# EAGLE design Ad8232_placa_C_malha (EAGLE 9.6.2)
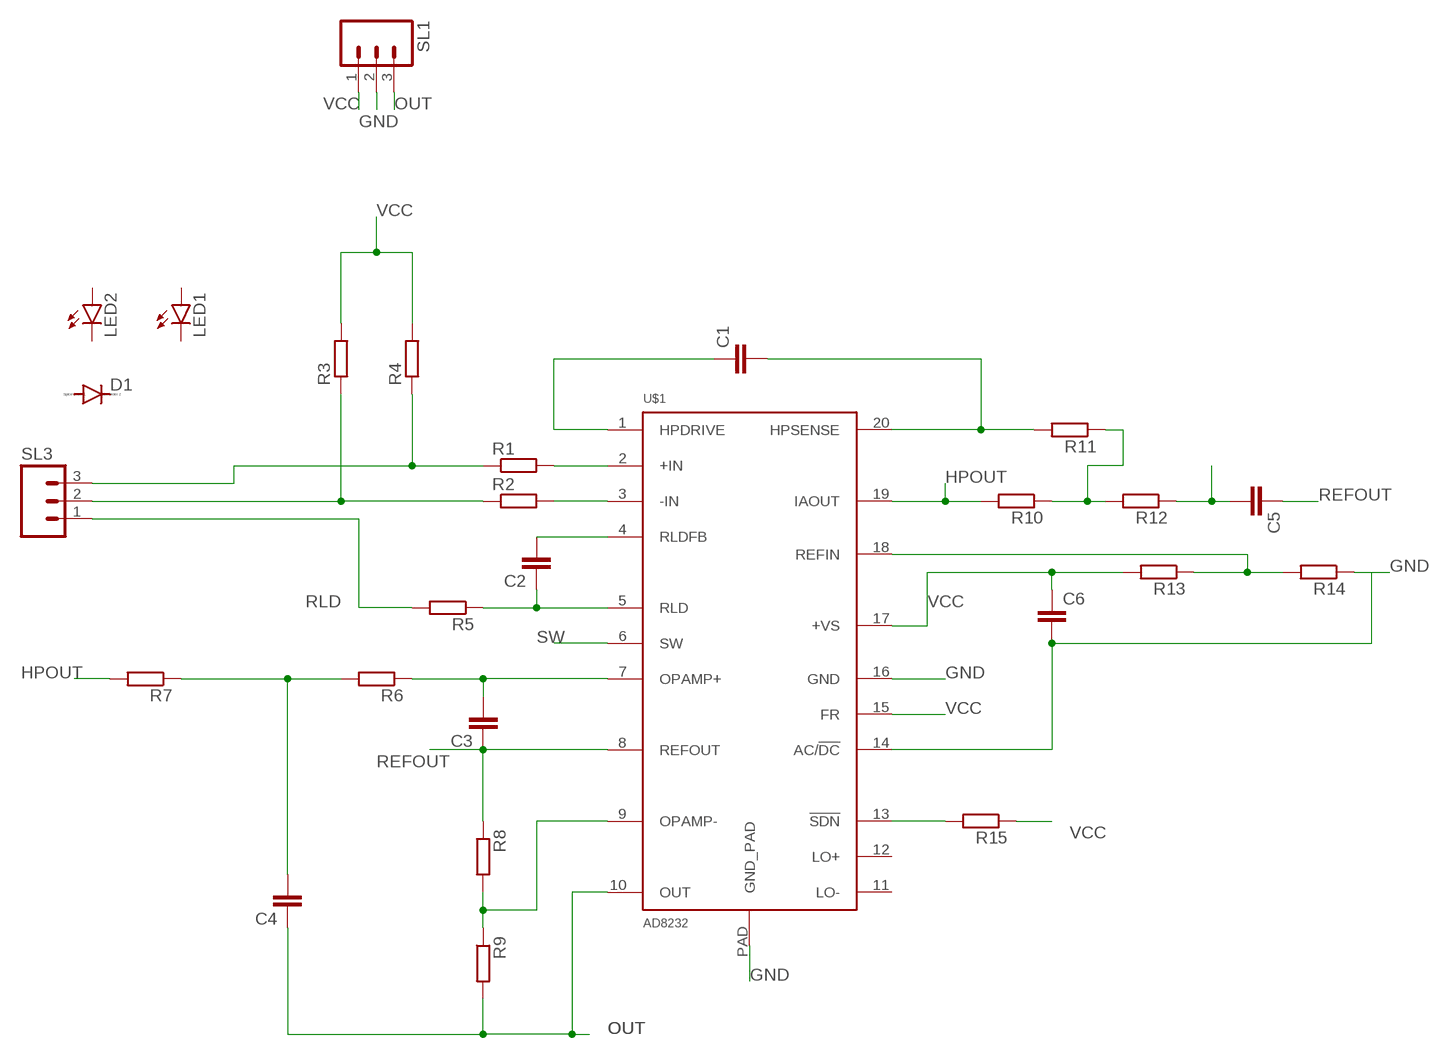
[diagram p0: schematic, sheet 1]

## Parts
C1  C-EUC0805  [C0805]
C2  C-EUC0805  [C0805]
C3  C-EUC0805  [C0805]
C4  C-EUC0805  [C0805]
C5  C-EUC0805  [C0805]
C6  C-EUC0805  [C0805]
D1  DIODE-MINIMELF  [MINIMELF]
LED1  LEDCHIPLED_0603  [CHIPLED_0603]
LED2  LEDCHIPLED_0603  [CHIPLED_0603]
R1  R-EU_R0805  [R0805]
R2  R-EU_R0805  [R0805]
R3  R-EU_R0805  [R0805]
R4  R-EU_R0805  [R0805]
R5  R-EU_R0805  [R0805]
R6  R-EU_R0805  [R0805]
R7  R-EU_R0805  [R0805]
R8  R-EU_R0805  [R0805]
R9  R-EU_R0805  [R0805]
R10  R-EU_R0805  [R0805]
R11  R-EU_R0805  [R0805]
R12  R-EU_R0805  [R0805]
R13  R-EU_R0805  [R0805]
R14  R-EU_R0805  [R0805]
R15  R-EU_R0805  [R0805]
SL1  M03  [03P]
SL3  M03  [03P]
U$1  AD8232  [LFCSP_20]

## Nets
GND: C6.2 R14.1 SL1.2 U$1.14(AC/!DC) U$1.16(GND) U$1.PAD(GND_PAD)
HPOUT: R7.2 R10.2 U$1.19(IAOUT)
N$1: C1.1 U$1.1(HPDRIVE)
N$2: C1.2 R11.2 U$1.20(HPSENSE)
N$3: R1.2 U$1.2(+IN)
N$4: R2.2 U$1.3(-IN)
N$5: R1.1 R4.1 SL3.3
N$6: R2.1 R3.1 SL3.2
N$7: C2.2 U$1.4(RLDFB)
N$8: C2.1 R5.1 U$1.5(RLD)
N$9: C3.2 R6.1 U$1.7(OPAMP+)
N$10: R13.1 R14.2 U$1.18(REFIN)
N$11: R8.2 R9.1 U$1.9(OPAMP-)
N$13: R10.1 R11.1 R12.2
N$14: C4.2 R6.2 R7.1
N$16: R15.2 U$1.13(!SDN)
OUT: C4.1 R9.2 SL1.3 U$1.10(OUT)
REFOUT: C3.1 C5.1 R8.1 U$1.8(REFOUT)
RLD: R5.2 SL3.1
SW: C5.2 R12.1 U$1.6(SW)
VCC: C6.1 R3.2 R4.2 R13.2 R15.1 SL1.1 U$1.15(FR) U$1.17(+VS)
Unconnected: D1.A D1.C LED1.A LED1.C LED2.A LED2.C U$1.11(LO-) U$1.12(LO+)

## Library data of the parts
C1-C6 = rcl:C-EU: CAPACITOR, European symbol
D1 = diode:DIODE-: DIODE
LED1 LED2 = led:LED: LED OSRAM: - CHIPLED LG R971, LG N971, LY N971, LG Q971, LY Q971, LO R971, LY R971 LH N974, LH R974 LS Q976, LO Q976, LY Q976 LO Q996 - Hyper CHIPLED LW Q18S LB Q993, LB Q99A, LB R99A - SideLED LS A670, LO A670, LY A670, LG A670, LP A670 LB A673, LV A673, LT A673, LW A673 LH A674 LY A675 LS A676, LA A676, LO A676, LY A676, LW A676 LS A679, LY A679, LG A679 - Hyper Micro SIDELED® LS Y876, LA Y876, LO Y876, LY Y876 LT Y87S - SmartLED LW L88C, LW L88S LB L89C, LB L89S, LG L890 LS L89K, LO L89K, LY L89K LS L896, LA L896, LO L896, LY L896 - TOPLED LS T670, LO T670, LY T670, LG T670, LP T670 LSG T670, LSP T670, LSY T670, LOP T670, LYG T670 LG T671, LOG T671, LSG T671 LB T673, LV T673, LT T673, LW T673 LH T674 LS T676, LA T676, LO T676, LY T676, LB T676, LH T676, LSB T676, LW T676 LB T67C, LV T67C, LT T67C, LS T67K, LO T67K, LY T67K, LW E67C LS E67B, LA E67B, LO E67B, LY E67B, LB E67C, LV E67C, LT E67C LW T67C LS T679, LY T679, LG T679 LS T770, LO T770, LY T770, LG T770, LP T770 LB T773, LV T773, LT T773, LW T773 LH T774 LS E675, LA E675, LY E675, LS T675 LS T776, LA T776, LO T776, LY T776, LB T776 LHGB T686 LT T68C, LB T68C - Hyper Mini TOPLED® LB M676 - Mini TOPLED Santana® LG M470 LS M47K, LO M47K, LY M47K Source: http://www.osram.convergy.de LUXEON: - LUMILED® LXK2-PW12-R00, LXK2-PW12-S00, LXK2-PW14-U00, LXK2-PW14-V00 LXK2-PM12-R00, LXK2-PM12-S00, LXK2-PM14-U00 LXK2-PE12-Q00, LXK2-PE12-R00, LXK2-PE12-S00, LXK2-PE14-T00, LXK2-PE14-U00 LXK2-PB12-K00, LXK2-PB12-L00, LXK2-PB12-M00, LXK2-PB14-N00, LXK2-PB14-P00, LXK2-PB14-Q00 LXK2-PR12-L00, LXK2-PR12-M00, LXK2-PR14-Q00, LXK2-PR14-R00 LXK2-PD12-Q00, LXK2-PD12-R00, LXK2-PD12-S00 LXK2-PH12-R00, LXK2-PH12-S00 LXK2-PL12-P00, LXK2-PL12-Q00, LXK2-PL12-R00 Source: www.luxeon.com KINGBRIGHT: KA-3528ASYC Source: www.kingbright.com
R1-R15 = rcl:R-EU_: RESISTOR, European symbol
SL1 SL3 = con-amp-quick:M03: AMP QUICK CONNECTOR; OC_FARNELL: unknown; OC_NEWARK: unknown
U$1 = AD8232:AD8232: Check prices <https://pricing.snapeda.com/parts/AD8232/Analog%20Devices/view-part?ref=eda>; AVAILABILITY: Not in stock; DESCRIPTION: AD8232 Sensor Signal Conditioner Interface Evaluation Board; MF: Analog Devices; MP: AD8232; PACKAGE: LFCSP-20 Analog Devices; PRICE: None

## Board
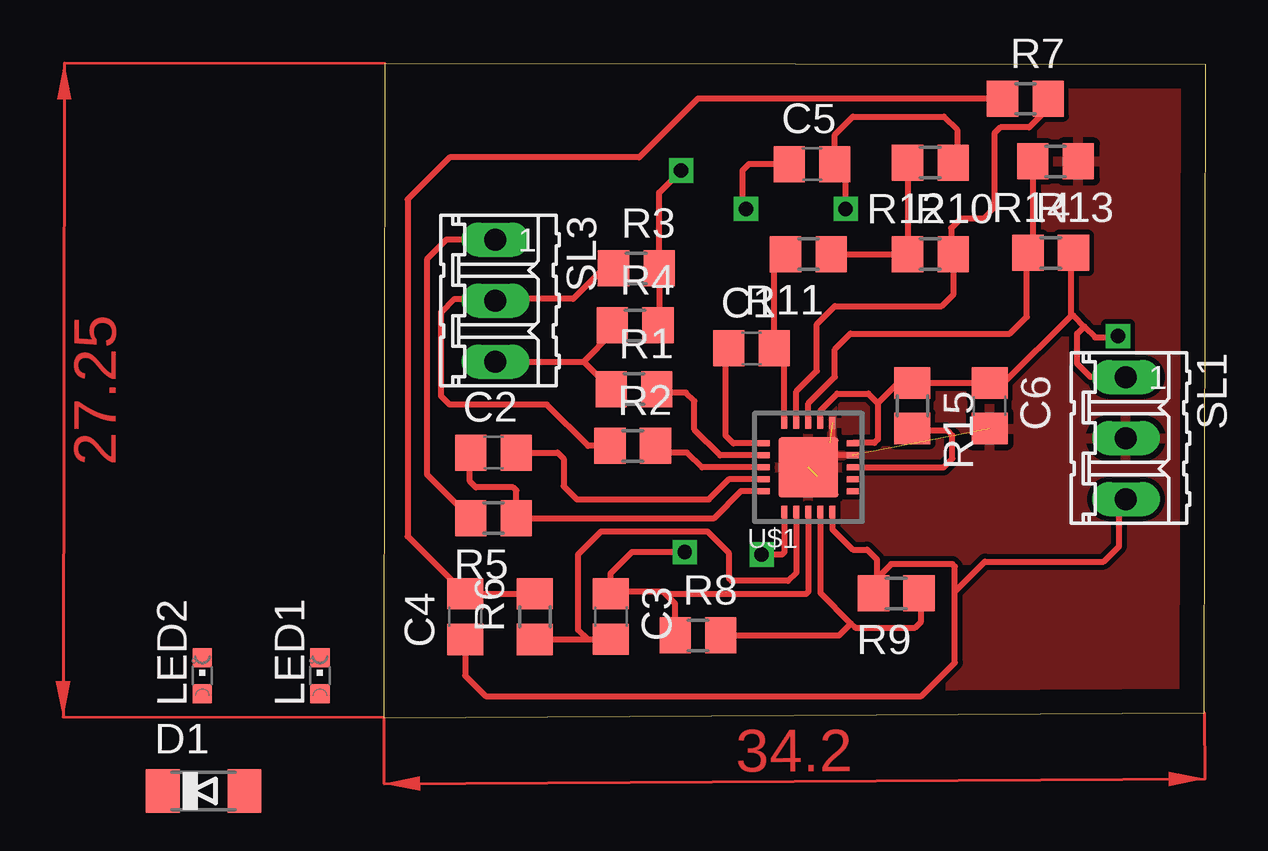
[diagram p1: board, top side]
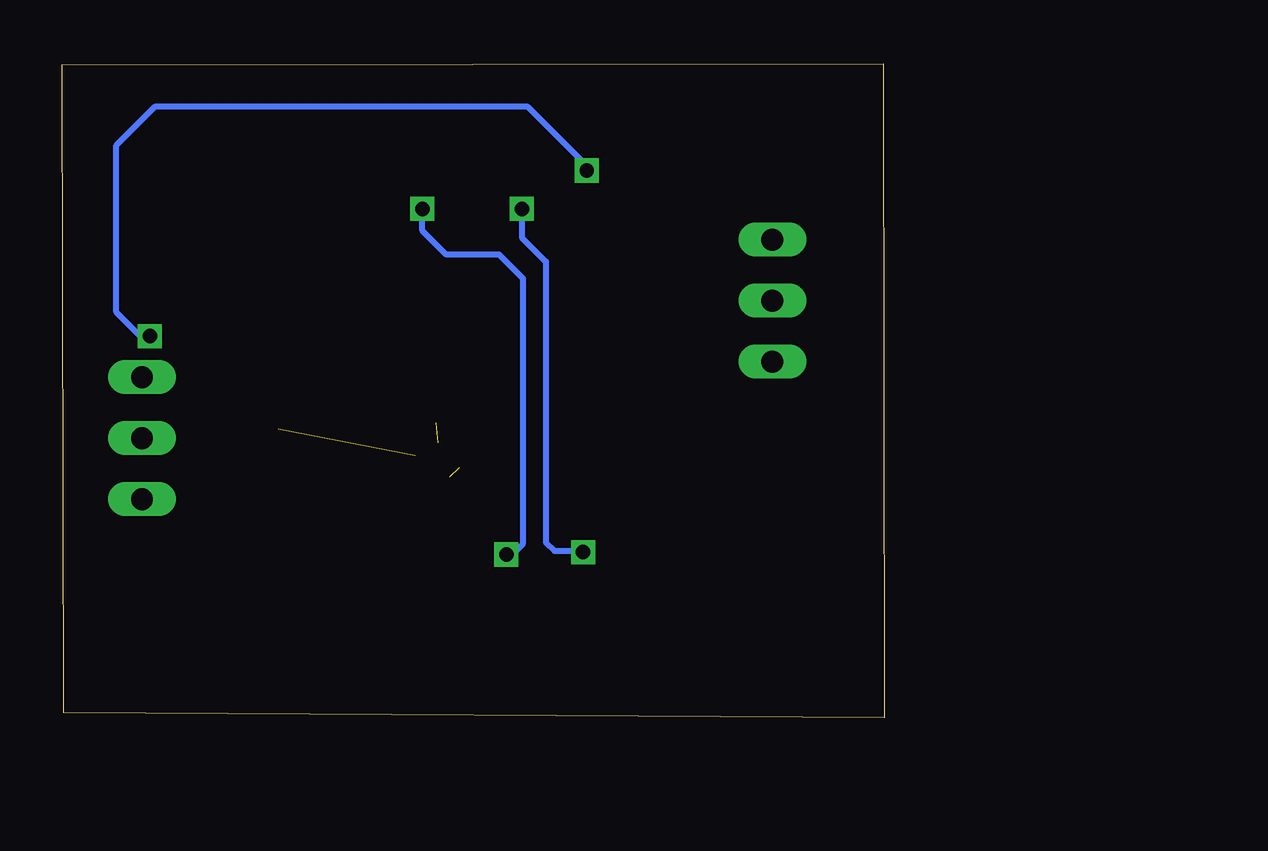
[diagram p2: board, bottom side, seen from below]

Size 34.25 x 27.25 mm. Coordinates in mm from the lower left corner, seen from the top.
Outline: 0,0 34.2,0.2 34.25,27.2 0.05,27.25 0,0
Copper layers (1*16): Top 0.035mm / dielectric 1.5mm / Bottom 0.035mm
Design rules "default": minimum track width 10mil, minimum drill 24mil, track to track 8mil, track to pad 8mil, pad to pad 8mil, via to via 8mil, smd to smd 8mil, copper to edge 40mil, drill to drill 8mil, minimum pad ring 10mil, minimum via ring 8mil, stop-mask expansion 4mil, vias tented up to drill 0mil, thermal gap 10mil

### Footprints (pad centres in the part's own frame; a part is rotated, then mirrored left to right if it is on the bottom)
C0805 = smd 1.3 x 1.5: 1 -0.95,0; 2 0.95,0
MINIMELF = smd 1.4 x 1.8: A 1.7,0; C -1.7,0
CHIPLED_0603 = smd 0.8 x 0.8: A 0,-0.75; C 0,0.75
R0805 = smd 1.3 x 1.5: 1 -0.95,0; 2 0.95,0
03P = drill 0.914 long: 1 -2.54,0; 2 0,0; 3 2.54,0
LFCSP_20 = smd 0.5 x 0.25: 1 -1.85,1; 2 -1.85,0.5; 3 -1.85,0; 4 -1.85,-0.5; 5 -1.85,-1; 11 1.85,-1; 12 1.85,-0.5; 13 1.85,0; 14 1.85,0.5; 15 1.85,1 | smd 0.25 x 0.5: 6 -1,-1.85; 7 -0.5,-1.85; 8 0,-1.85; 9 0.5,-1.85; 10 1,-1.85; 16 1,1.85; 17 0.5,1.85; 18 0,1.85; 19 -0.5,1.85; 20 -1,1.85 | smd 2.5 x 2.5: PAD 0,0

### Placement (x,y rotation side)
C1  15.33,15.39 0 top
C2  4.58,11.05 0 top
C3  9.47,4.22 270 top
C4  3.4,4.21 90 top
C5  17.85,23.07 0 top
C6  25.25,13 270 top
D1  -7.5,-3.05 0 top  (outside the outline)
LED1  -2.65,1.75 0 top
LED2  -7.55,1.75 0 top  (outside the outline)
R1  10.43,13.69 0 top
R2  10.38,11.33 0 top
R3  10.53,18.72 0 top
R4  10.48,16.35 0 top
R5  4.58,8.32 180 top
R6  6.3,4.21 90 top
R7  26.74,25.79 0 top
R8  13.1,3.43 0 top
R9  21.36,5.18 180 top
R10  22.78,19.32 0 top
R11  17.7,19.32 180 top
R12  22.78,23.13 180 top
R13  27.8,19.37 0 top
R14  28,23.18 180 top
R15  22.03,13 270 top
SL1  30.93,11.65 270 top
SL3  4.66,17.38 270 top
U$1  17.7,10.43 0 top

### Tracks (layer width: path | path; a pad name or v marks a point on that pad's centre or on a via)
GND  (3 unrouted)
  Top 0.254: 18.6,11.45 18.5,11.35 | 18.1,10.05 18.1,10.7 18.33,10.93 U$1.14 | U$1.16 18.7,11.43 U$1.PAD
  pour Top: 9.65,27.4 34.3,27.4 34.3,0.15 9.65,0.15
HPOUT
  Top 0.254: U$1.19 17.2,13.6 18.05,14.45 18.05,16.4 18.8,17.15 23.25,17.15 23.75,17.65 23.75,19.3 R10.2 23.65,19.4 23.65,20.4 24.05,20.8 25,20.8 25.45,21.25 25.45,24.35 25.7,24.6 26.9,24.6 27.69,25.39 R7.2
N$1
  Top 0.254: U$1.1 14.57,11.43 14.25,11.75 14.25,15.26 C1.1
N$2
  Top 0.254: U$1.20 16.7,14.97 C1.2 16.28,18.85 R11.2
N$3
  Top 0.254: U$1.2 14.02,10.93 12.95,12 12.95,13.2 12.6,13.55 11.52,13.55 R1.2
N$4
  Top 0.254: U$1.3 13.27,10.43 12.65,11.05 11.61,11.05 R2.2
N$5
  Top 0.254: SL3.3 8.33,14.84 | 8.33,14.84 R1.1 | R4.1 9.53,16.04 8.33,14.84
N$6
  Top 0.254: R2.1 8.52,11.33 6.8,13.05 2.75,13.05 2.4,13.4 2.4,16.9 2.95,17.45 4.59,17.45 SL3.2 4.73,17.45 7.9,17.45 9.17,18.72 R3.1
N$7
  Top 0.254: C2.2 7.25,11.05 7.5,10.8 7.5,9.65 8.05,9.1 13.55,9.1 14.38,9.93 U$1.4
N$8
  Top 0.254: U$1.5 15.83,9.45 14.9,9.45 13.77,8.32 R5.1 5.53,9.47 5.4,9.6 3.85,9.6 3.6,9.85 3.6,11.02 C2.1
N$9
  Top 0.254: R6.1 8.5,3.26 | 8.5,3.26 C3.2 | U$1.7 17.2,6.05 16.85,5.7 14.5,5.7 14.4,5.8 14.4,6.85 13.5,7.75 9.05,7.75 8.1,6.8 8.1,3.66 8.5,3.26
N$10
  Top 0.254: R14.2 27.05,19.57 R13.1 26.8,19.32 26.8,16.7 26.1,16 19.45,16 18.8,15.35 18.8,14.2 17.7,13.1 U$1.18
N$11
  Top 0.254: U$1.9 18.2,5.2 19.48,3.92 | 19.48,3.92 19.65,3.75 22.15,3.75 22.4,4 22.4,5.09 R9.1 | R8.2 18.98,3.43 19.48,3.92
N$13
  Top 0.254: R12.2 R10.1 R11.1
N$14
  Top 0.254: R6.2 C4.2 1,7.56 1,21.6 2.75,23.35 10.65,23.35 13.09,25.79 R7.1
N$16
  Top 0.254: U$1.13 23.33,10.43 23.7,10.8 23.7,11.75 23.5,11.95 22.13,11.95 R15.2
OUT
  Top 0.254: U$1.10 18.7,7.85 19.55,7 20.15,7 20.55,6.6 20.55,5.8 | 20.55,5.8 20.55,5.32 R9.2 | C4.1 3.4,1.75 4.25,0.9 22.4,0.9 23.8,2.3 23.8,5.25 | 23.8,5.25 23.8,6.3 23.7,6.4 21.15,6.4 20.55,5.8 | 23.8,5.25 25.05,6.5 30,6.5 30.65,7.15 30.65,8.83 SL1.3
REFOUT  (via drill 0.6)
  Top 0.254: C5.1 15.22,23.07 14.95,22.8 14.95,21.35 v15.1,21.2 | v12.55,6.9 10.35,6.9 9.45,6 9.45,5.19 C3.1 9.55,5.25 11.65,5.25 11.75,5.15 | R8.1 12.15,4.75 11.75,5.15 | U$1.8 17.7,5.25 17.6,5.15 11.75,5.15
  Bottom 0.254: v15.1,21.2 15.1,20 14.1,19 14.1,7.3 13.75,6.95 12.6,6.95 v12.55,6.9
RLD
  Top 0.254: SL3.1 2.62,19.92 1.8,19.1 1.8,10.15 R5.2
SW  (via drill 0.6)
  Top 0.254: R12.1 23.9,23.3 23.9,24.5 23.35,25.05 19.55,25.05 18.8,24.3 C5.2 19.25,22.62 v19.25,21.2 | U$1.6 16.7,6.9 16.6,6.8 v15.75,6.8
  Bottom 0.254: v15.75,6.8 15.5,6.8 15.05,7.25 15.05,18.3 16.05,19.3 18.25,19.3 19.25,20.3 v19.25,21.2
VCC  (via drill 0.6)
  Top 0.254: 28.65,16.75 28.65,19.27 R13.2 | R4.2 11.48,16.4 R3.2 11.48,21.88 v12.4,22.8 | U$1.17 18.2,12.8 18.9,13.5 20.2,13.5 20.6,13.1 | 20.6,13.1 20.6,11.6 20.45,11.45 19.57,11.45 U$1.15 | 20.6,13.1 21.45,13.95 R15.1 C6.1 25.85,13.95 28.65,16.75 | 28.65,16.75 28.75,16.75 29.2,16.3 | 29.2,16.3 29.65,15.85 30.55,15.85 v30.6,15.9 | SL1.1 29.46,14.19 28.9,14.75 28.9,16 29.2,16.3
  Bottom 0.254: v12.4,22.8 12.4,23 14.85,25.45 30.4,25.45 32,23.85 32,16.9 31,15.9 v30.6,15.9
(copper drawn outside any net)
  shapes: Top area x2